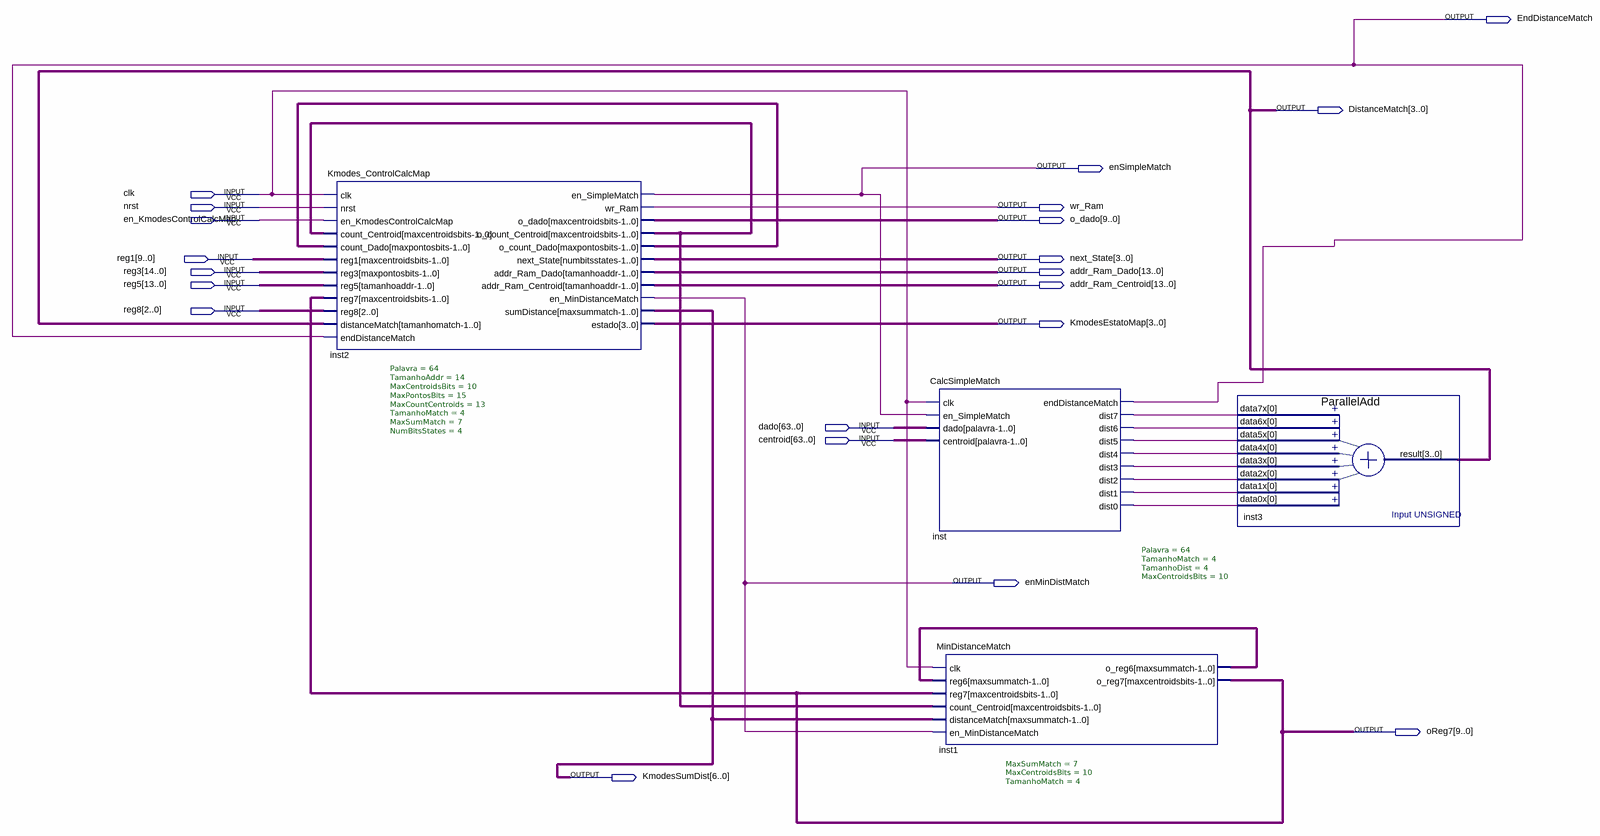
[diagram p0: schematic sheet]
// Quartus schematic Kmodes_CalcMapModule.bdf as structural Verilog: 4 symbols, 21 pins
module Kmodes_CalcMapModule (
  input  clk,
  input  nrst,
  input  en_KmodesControlCalcMap,
  input  [9:0] reg1,
  input  [14:0] reg3,
  input  [13:0] reg5,
  input  [2:0] reg8,
  input  [63:0] dado,
  input  [63:0] centroid,
  output EndDistanceMatch,
  output [3:0] DistanceMatch,
  output enSimpleMatch,
  output wr_Ram,
  output [9:0] o_dado,
  output [3:0] next_State,
  output [13:0] addr_Ram_Dado,
  output [13:0] addr_Ram_Centroid,
  output [3:0] KmodesEstatoMap,
  output enMinDistMatch,
  output [9:0] oReg7,
  output [6:0] KmodesSumDist
);

  wire inst_dist0, inst_dist1, inst_dist2, inst_dist3, inst_dist4, inst_dist5, inst_dist6, inst_dist7;
  wire [6:0] inst1_o_reg6;
  wire [9:0] inst2_o_count_centroid;
  wire [14:0] inst2_o_count_dado;

  Kmodes_ControlCalcMap #(.Palavra(64), .TamanhoAddr(14), .MaxCentroidsBits(10), .MaxPontosBits(15), .MaxCountCentroids(13), .TamanhoMatch(4), .MaxSumMatch(7), .NumBitsStates(4)) inst2 (
    .clk(clk), .nrst(nrst), .en_KmodesControlCalcMap(en_KmodesControlCalcMap),
    .count_Centroid(inst2_o_count_centroid), .count_Dado(inst2_o_count_dado), .reg1(reg1), .reg3(reg3),
    .reg5(reg5), .reg7(oReg7), .reg8(reg8), .distanceMatch(DistanceMatch),
    .endDistanceMatch(EndDistanceMatch), .en_SimpleMatch(enSimpleMatch), .wr_Ram(wr_Ram), .o_dado(o_dado),
    .o_count_Centroid(inst2_o_count_centroid), .o_count_Dado(inst2_o_count_dado), .next_State(next_State),
    .addr_Ram_Dado(addr_Ram_Dado), .addr_Ram_Centroid(addr_Ram_Centroid),
    .en_MinDistanceMatch(enMinDistMatch), .sumDistance(KmodesSumDist), .estado(KmodesEstatoMap));
  CalcSimpleMatch #(.Palavra(64), .TamanhoMatch(4), .TamanhoDist(4), .MaxCentroidsBits(10)) inst (
    .clk(clk), .en_SimpleMatch(enSimpleMatch), .dado(dado), .centroid(centroid),
    .endDistanceMatch(EndDistanceMatch), .dist7(inst_dist7), .dist6(inst_dist6), .dist5(inst_dist5),
    .dist4(inst_dist4), .dist3(inst_dist3), .dist2(inst_dist2), .dist1(inst_dist1), .dist0(inst_dist0));
  MinDistanceMatch #(.MaxSumMatch(7), .MaxCentroidsBits(10), .TamanhoMatch(4)) inst1 (
    .clk(clk), .reg6(inst1_o_reg6), .reg7(oReg7), .count_Centroid(inst2_o_count_centroid),
    .distanceMatch(KmodesSumDist), .en_MinDistanceMatch(enMinDistMatch), .o_reg6(inst1_o_reg6), .o_reg7(oReg7));
  ParallelAdd inst3 (
    .data7x(inst_dist7), .data6x(inst_dist6), .data5x(inst_dist5), .data4x(inst_dist4), .data3x(inst_dist3),
    .data2x(inst_dist2), .data1x(inst_dist1), .data0x(inst_dist0), .result(DistanceMatch));
endmodule
